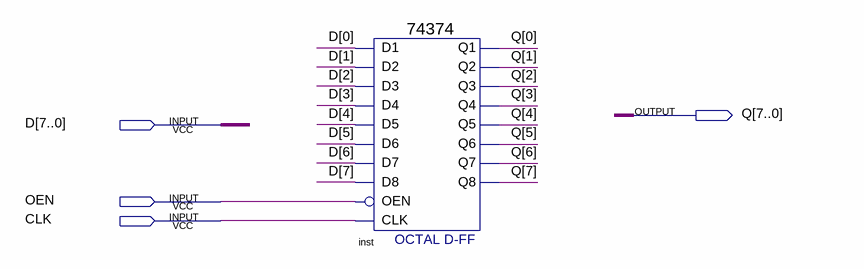
[diagram p0: schematic sheet]
// Quartus schematic R.bdf as structural Verilog: 1 symbols, 4 pins
module R (
  input  [7:0] D,
  input  OEN,
  input  CLK,
  output [7:0] Q
);

  \74374  inst (
    .D1(D[0]), .D2(D[1]), .D3(D[2]), .D4(D[3]), .D6(D[5]), .D5(D[4]), .OEN(OEN), .D8(D[7]), .D7(D[6]),
    .CLK(CLK), .Q2(Q[1]), .Q3(Q[2]), .Q5(Q[4]), .Q4(Q[3]), .Q6(Q[5]), .Q7(Q[6]), .Q8(Q[7]), .Q1(Q[0]));
endmodule
